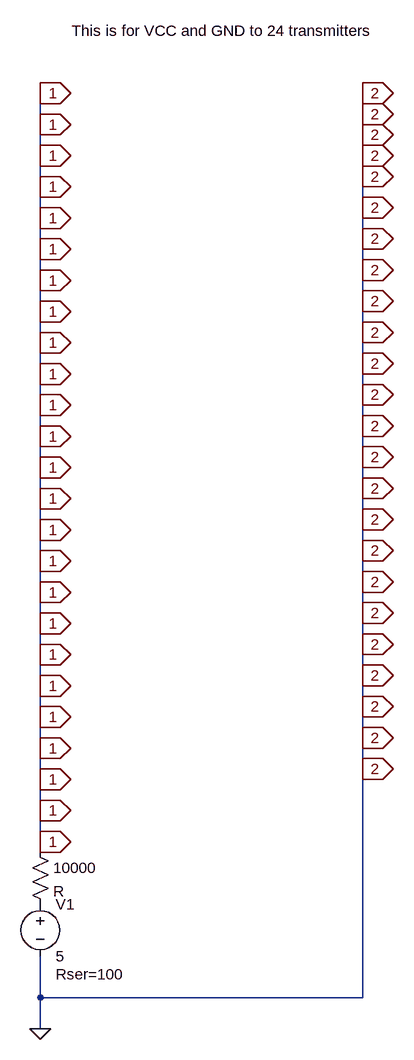
[diagram p0: schematic External_circuit.asc]
External_circuit.asc, the LTspice schematic file:
Version 4.1
SHEET 1 880 680
WIRE -16 -1168 -16 -1184
WIRE 480 -1168 480 -1184
WIRE 480 -1136 480 -1168
WIRE -16 -1120 -16 -1168
WIRE 480 -1104 480 -1136
WIRE -16 -1072 -16 -1120
WIRE 480 -1072 480 -1104
WIRE 480 -1040 480 -1072
WIRE -16 -1024 -16 -1072
WIRE 480 -992 480 -1040
WIRE -16 -976 -16 -1024
WIRE 480 -944 480 -992
WIRE -16 -928 -16 -976
WIRE 480 -896 480 -944
WIRE -16 -880 -16 -928
WIRE 480 -848 480 -896
WIRE -16 -832 -16 -880
WIRE 480 -800 480 -848
WIRE -16 -784 -16 -832
WIRE 480 -752 480 -800
WIRE -16 -736 -16 -784
WIRE 480 -704 480 -752
WIRE -16 -688 -16 -736
WIRE 480 -656 480 -704
WIRE -16 -640 -16 -688
WIRE 480 -608 480 -656
WIRE -16 -592 -16 -640
WIRE 480 -560 480 -608
WIRE -16 -544 -16 -592
WIRE 480 -512 480 -560
WIRE -16 -496 -16 -544
WIRE 480 -464 480 -512
WIRE -16 -448 -16 -496
WIRE 480 -416 480 -464
WIRE -16 -400 -16 -448
WIRE 480 -368 480 -416
WIRE -16 -352 -16 -400
WIRE 480 -320 480 -368
WIRE -16 -304 -16 -352
WIRE 480 -272 480 -320
WIRE -16 -256 -16 -304
WIRE 480 -224 480 -272
WIRE -16 -208 -16 -256
WIRE 480 -176 480 -224
WIRE -16 -160 -16 -208
WIRE 480 -128 480 -176
WIRE -16 -112 -16 -160
WIRE -16 -64 -16 -112
WIRE -16 -16 -16 -64
WIRE -16 0 -16 -16
WIRE -16 224 -16 160
WIRE 480 224 480 -128
WIRE 480 224 -16 224
WIRE -16 272 -16 224
FLAG -16 272 0
FLAG -16 -1168 1
IOPIN -16 -1168 Out
FLAG -16 -1120 1
IOPIN -16 -1120 Out
FLAG -16 -1072 1
IOPIN -16 -1072 Out
FLAG -16 -1024 1
IOPIN -16 -1024 Out
FLAG -16 -976 1
IOPIN -16 -976 Out
FLAG -16 -928 1
IOPIN -16 -928 Out
FLAG -16 -880 1
IOPIN -16 -880 Out
FLAG -16 -832 1
IOPIN -16 -832 Out
FLAG -16 -784 1
IOPIN -16 -784 Out
FLAG -16 -736 1
IOPIN -16 -736 Out
FLAG -16 -688 1
IOPIN -16 -688 Out
FLAG -16 -640 1
IOPIN -16 -640 Out
FLAG -16 -592 1
IOPIN -16 -592 Out
FLAG -16 -544 1
IOPIN -16 -544 Out
FLAG -16 -496 1
IOPIN -16 -496 Out
FLAG -16 -448 1
IOPIN -16 -448 Out
FLAG -16 -400 1
IOPIN -16 -400 Out
FLAG -16 -352 1
IOPIN -16 -352 Out
FLAG -16 -304 1
IOPIN -16 -304 Out
FLAG -16 -256 1
IOPIN -16 -256 Out
FLAG -16 -208 1
IOPIN -16 -208 Out
FLAG -16 -160 1
IOPIN -16 -160 Out
FLAG -16 -112 1
IOPIN -16 -112 Out
FLAG -16 -64 1
IOPIN -16 -64 Out
FLAG -16 -16 1
IOPIN -16 -16 Out
FLAG 480 -1168 2
IOPIN 480 -1168 Out
FLAG 480 -1136 2
IOPIN 480 -1136 Out
FLAG 480 -1104 2
IOPIN 480 -1104 Out
FLAG 480 -1072 2
IOPIN 480 -1072 Out
FLAG 480 -1040 2
IOPIN 480 -1040 Out
FLAG 480 -992 2
IOPIN 480 -992 Out
FLAG 480 -944 2
IOPIN 480 -944 Out
FLAG 480 -896 2
IOPIN 480 -896 Out
FLAG 480 -848 2
IOPIN 480 -848 Out
FLAG 480 -800 2
IOPIN 480 -800 Out
FLAG 480 -752 2
IOPIN 480 -752 Out
FLAG 480 -704 2
IOPIN 480 -704 Out
FLAG 480 -656 2
IOPIN 480 -656 Out
FLAG 480 -608 2
IOPIN 480 -608 Out
FLAG 480 -560 2
IOPIN 480 -560 Out
FLAG 480 -512 2
IOPIN 480 -512 Out
FLAG 480 -464 2
IOPIN 480 -464 Out
FLAG 480 -416 2
IOPIN 480 -416 Out
FLAG 480 -368 2
IOPIN 480 -368 Out
FLAG 480 -320 2
IOPIN 480 -320 Out
FLAG 480 -272 2
IOPIN 480 -272 Out
FLAG 480 -224 2
IOPIN 480 -224 Out
FLAG 480 -176 2
IOPIN 480 -176 Out
FLAG 480 -128 2
IOPIN 480 -128 Out
SYMBOL voltage -16 64 R0
WINDOW 123 0 0 Left 0
WINDOW 39 24 124 Left 2
SYMATTR InstName V1
SYMATTR Value 5
SYMATTR SpiceLine Rser=100
SYMBOL res -32 -16 R0
SYMATTR InstName 10000
TEXT 32 -1264 Left 2 !This is for VCC and GND to 24 transmitters

The netlist it stands for:
* External_circuit.asc
V1 P001 0 5 Rser=100
R§10000 1 P001 R
This is for VCC and GND to 24 transmitters
.backanno
.end